# EAGLE design Splitter (EAGLE 6.4)
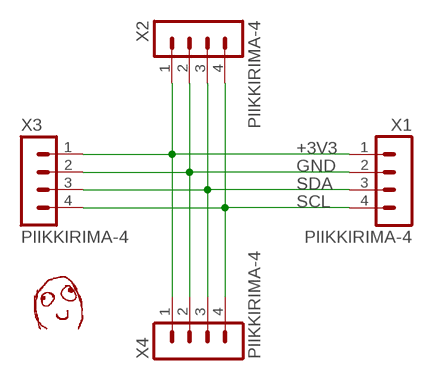
[diagram p0: schematic, sheet 1]

## Parts
U$1  DAFUG  [DAFUG]
X1  PIIKKIRIMA-4  [PIIKKIRIMA-4]
X2  PIIKKIRIMA-4  [PIIKKIRIMA-4]
X3  PIIKKIRIMA-4  [PIIKKIRIMA-4]
X4  PIIKKIRIMA-4  [PIIKKIRIMA-4]

## Nets
+3V3: X1.1 X2.1 X3.1 X4.1
GND: X1.2 X2.2 X3.2 X4.2
SCL: X1.4 X2.4 X3.4 X4.4
SDA: X1.3 X2.3 X3.3 X4.3

## Library data of the parts
U$1 = dafug:DAFUG
X1-X4 = OMAT_IC:PIIKKIRIMA-4

## Board
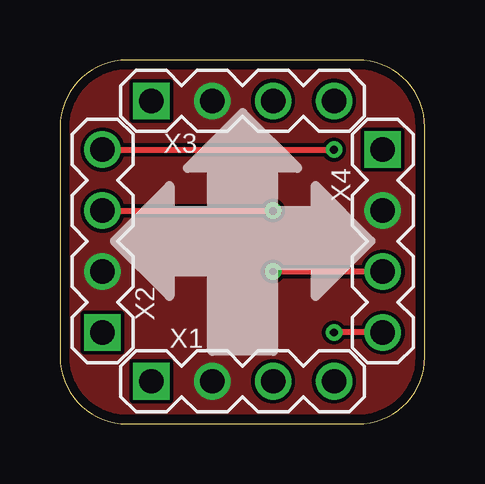
[diagram p1: board, top side]
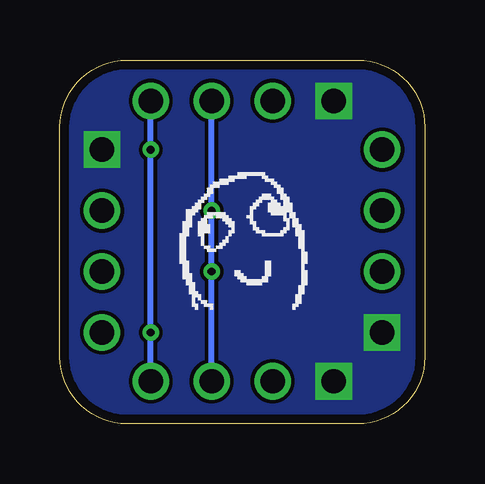
[diagram p2: board, bottom side, seen from below]

Size 15.22 x 15.16 mm. Coordinates in mm from the lower left corner, seen from the top.
Outline: 0,12.37 0,2.79 arc90 2.79,0 12.43,0 arc90 15.22,2.79 15.22,12.37 arc90 12.43,15.16 2.79,15.16 arc90 0,12.37
Copper layers (1*16): Top 0.0356mm / dielectric 1.5011mm / Bottom 0.0356mm
Design rules "LaenPCBOrder": minimum track width 6mil, minimum drill 13mil, track to track 6mil, track to pad 6mil, pad to pad 6mil, via to via 6mil, smd to smd 6mil, copper to edge 15mil, drill to drill 6mil, minimum pad ring 7mil, minimum via ring 7mil, stop-mask expansion 4mil, vias tented up to drill 0mil, thermal gap 10mil

### Footprints (pad centres in the part's own frame; a part is rotated, then mirrored left to right if it is on the bottom)
PIIKKIRIMA-4 = drill 1.016 square: 1 0,0 | drill 1.016: 2 2.54,0; 3 5.08,0; 4 7.62,0

### Placement (x,y rotation side)
U$1  7.37,7.37 0 bottom
X1  3.81,1.78 0 top
X2  1.78,3.81 90 top
X3  3.81,13.46 0 top
X4  13.46,11.43 270 top

### Tracks (layer width: path | path; a pad name or v marks a point on that pad's centre or on a via)
+3V3
  pour Bottom (no thermals): 0,14.99 15.24,14.99 15.24,0 0,0
GND
  pour Top (no thermals): 0,14.99 14.73,14.99 15.24,14.73 15.24,0 0,0
SCL  (via drill 0.33)
  Top 0.254: X4.4 v11.43,3.81 | X2.4 v11.43,11.43
  Bottom 0.254: X1.4 v11.43,3.81 v11.43,11.43 X3.4
SDA  (via drill 0.33)
  Top 0.254: X2.3 v8.89,8.89 | X4.3 v8.89,6.35
  Bottom 0.254: X1.3 v8.89,6.35 v8.89,8.89 X3.3